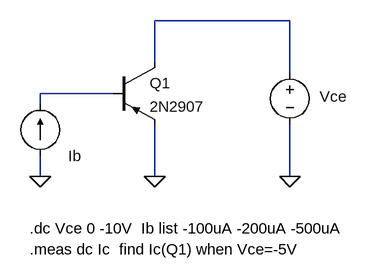
[diagram p0: schematic BT-CE-OUT-3.asc]
BT-CE-OUT-3.asc, the LTspice schematic file:
Version 4
SHEET 1 880 680
WIRE 416 16 208 16
WIRE 208 80 208 16
WIRE 416 96 416 16
WIRE 144 128 32 128
WIRE 32 144 32 128
WIRE 32 256 32 224
WIRE 208 256 208 176
WIRE 416 256 416 176
FLAG 208 256 0
FLAG 32 256 0
FLAG 416 256 0
SYMBOL voltage 416 80 R0
WINDOW 3 35 66 Invisible 2
WINDOW 123 0 0 Left 2
WINDOW 39 0 0 Left 2
WINDOW 0 46 53 Left 2
SYMATTR Value 0
SYMATTR InstName Vce
SYMBOL current 32 224 R180
WINDOW 0 -63 0 Left 2
WINDOW 3 -66 28 Invisible 2
WINDOW 123 0 0 Left 2
WINDOW 39 0 0 Left 2
SYMATTR InstName Ib
SYMATTR Value 0
SYMBOL pnp 144 80 R0
SYMATTR InstName Q1
SYMATTR Value 2N2907
TEXT 16 336 Left 2 !.dc Vce 0 -10V  Ib list -100uA -200uA -500uA
TEXT 16 368 Left 2 !.meas dc Ic  find Ic(Q1) when Vce=-5V

The netlist it stands for:
* BT-CE-OUT-3.asc
Vce N001 0 0
Ib 0 N002 0
Q1 N001 N002 0 0 2N2907
.model NPN NPN
.model PNP PNP
.lib standard.bjt
.dc Vce 0 -10V  Ib list -100uA -200uA -500uA
.meas dc Ic  find Ic(Q1) when Vce=-5V
.backanno
.end